# EAGLE design board (EAGLE 6.5.0)
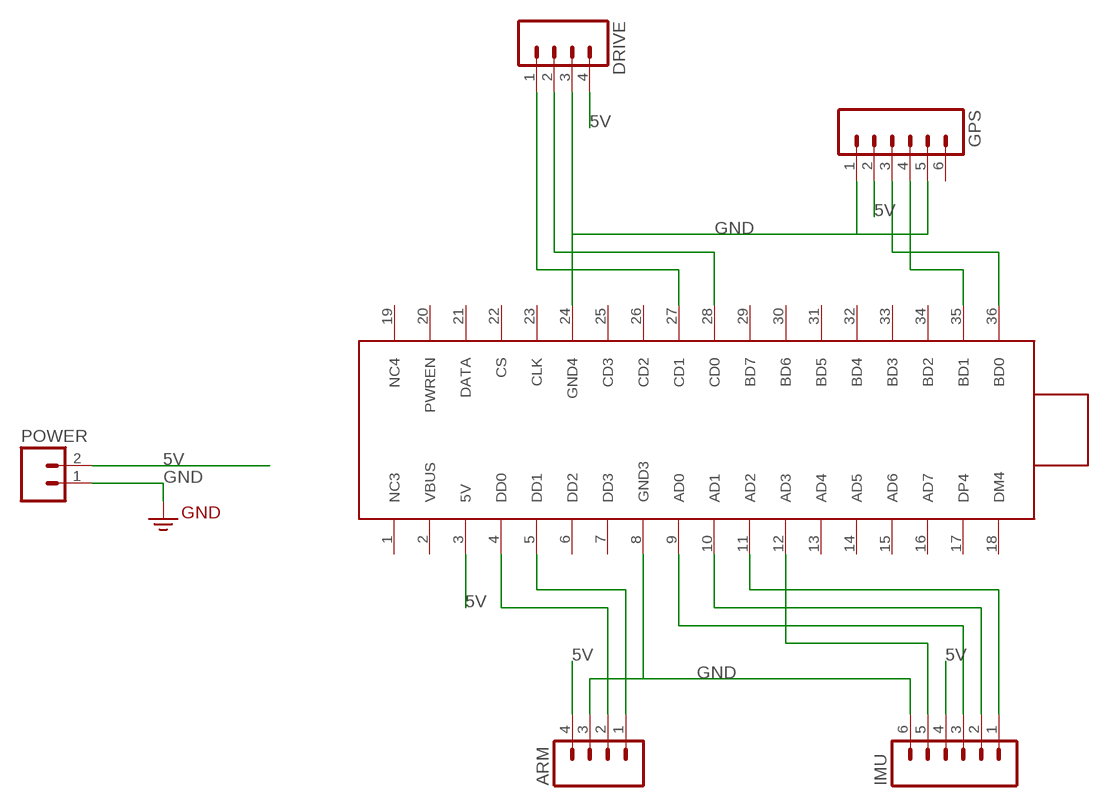
[diagram p0: schematic, sheet 1]

## Parts
ARM  M04PTH  [1X04]
DRIVE  M04PTH  [1X04]
GPS  M06SILK_FEMALE_PTH  [1X06]
IMU  M06SILK_FEMALE_PTH  [1X06]
POWER  M02PTH  [1X02]
U$1  HUB  [HUB]

## Nets
5V: ARM.4 DRIVE.4 GPS.2 IMU.4 POWER.2 U$1.3(5V)
GND: ARM.3 DRIVE.3 GPS.1 GPS.5 IMU.6 POWER.1 U$1.8(GND3) U$1.24(GND4) ; supply symbol labelled GND2
N$1: ARM.2 U$1.4(DD0)
N$2: ARM.1 U$1.5(DD1)
N$3: DRIVE.2 U$1.28(CD0)
N$4: DRIVE.1 U$1.27(CD1)
N$5: IMU.3 U$1.9(AD0)
N$6: IMU.2 U$1.10(AD1)
N$7: IMU.5 U$1.12(AD3)
N$8: IMU.1 U$1.11(AD2)
N$9: GPS.3 U$1.36(BD0)
N$10: GPS.4 U$1.35(BD1)
Unconnected: GPS.6 U$1.1(NC3) U$1.2(VBUS) U$1.6(DD2) U$1.7(DD3) U$1.13(AD4) U$1.14(AD5) U$1.15(AD6) U$1.16(AD7) U$1.17(DP4) U$1.18(DM4) U$1.19(NC4) U$1.20(PWREN) U$1.21(DATA) U$1.22(CS) U$1.23(CLK) U$1.25(CD3) U$1.26(CD2) U$1.29(BD7) U$1.30(BD6) U$1.31(BD5) U$1.32(BD4) U$1.33(BD3) U$1.34(BD2)

## Library data of the parts
ARM DRIVE = SparkFun-Connectors:M04: Header 4 Standard 4-pin 0.1" header. Use with straight break away headers (SKU : PRT-00116), right angle break away headers (PRT-00553), swiss pins (PRT-00743), machine pins (PRT-00117), and female headers (PRT-00115). Molex polarized connector foot print use with SKU : PRT-08231 with associated crimp pins and housings. 1MM SMD Version SKU: PRT-10208
GPS IMU = SparkFun-Connectors:M06: Header 6 Standard 6-pin 0.1" header. Use with straight break away headers (SKU : PRT-00116), right angle break away headers (PRT-00553), swiss pins (PRT-00743), machine pins (PRT-00117), and female headers (PRT-00115). Molex polarized connector foot print use with SKU : PRT-08094 with associated crimp pins and housings. NOTES ON THE VARIANTS LOCK and LOCK_LONGPADS... This footprint was designed to help hold the alignment of a through-hole component (i.e. 6-pin header) while soldering it into place. You may notice that each hole has been shifted either up or down by 0.005 of an inch from it's more standard position (which is a perfectly straight line). This slight alteration caused the pins (the squares in the middle) to touch the edges of the holes. Because they are alternating, it causes a "brace" to hold the component in place. 0.005 has proven to be the perfect amount of "off-center" position when using our standard breakaway headers. Although looks a little odd when you look at the bare footprint, once you have a header in there, the alteration is very hard to notice. Also,if you push a header all the way into place, it is covered up entirely on the bottom side. This idea of altering the position of holes to aid alignment will be further integrated into the Sparkfun Library for other footprints. It can help hold any component with 3 or more connection pins.; PROD_ID: CONN-08437
POWER = SparkFun-Connectors:M02: Standard 2-pin 0.1" header. Use with - straight break away headers ( PRT-00116) - right angle break away headers (PRT-00553) - swiss pins (PRT-00743) - machine pins (PRT-00117) - female headers (PRT-00115) Molex polarized connector foot print use with: PRT-08233 with associated crimp pins and housings. 2.54_SCREWTERM for use with PRT-10571. 3.5mm Screw Terminal footprints for PRT-08084 5mm Screw Terminal footprints for use with PRT-08432
U$1 = ft4232-usb-hub:HUB

## Board
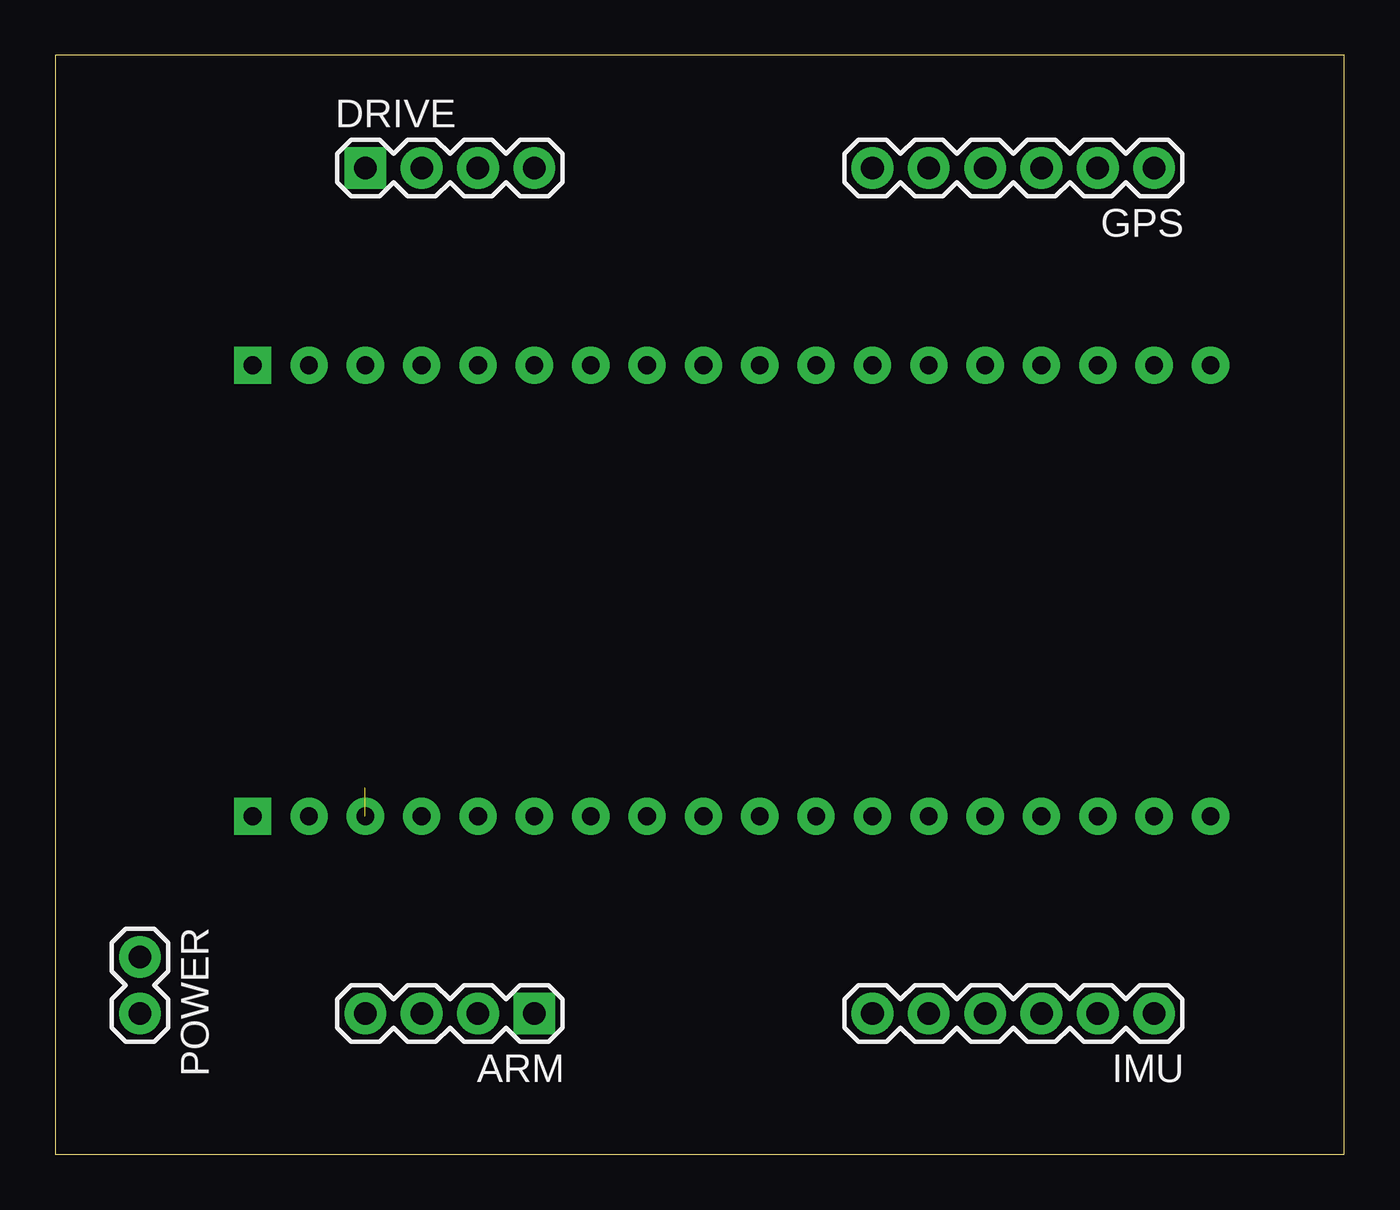
[diagram p1: board, top side]
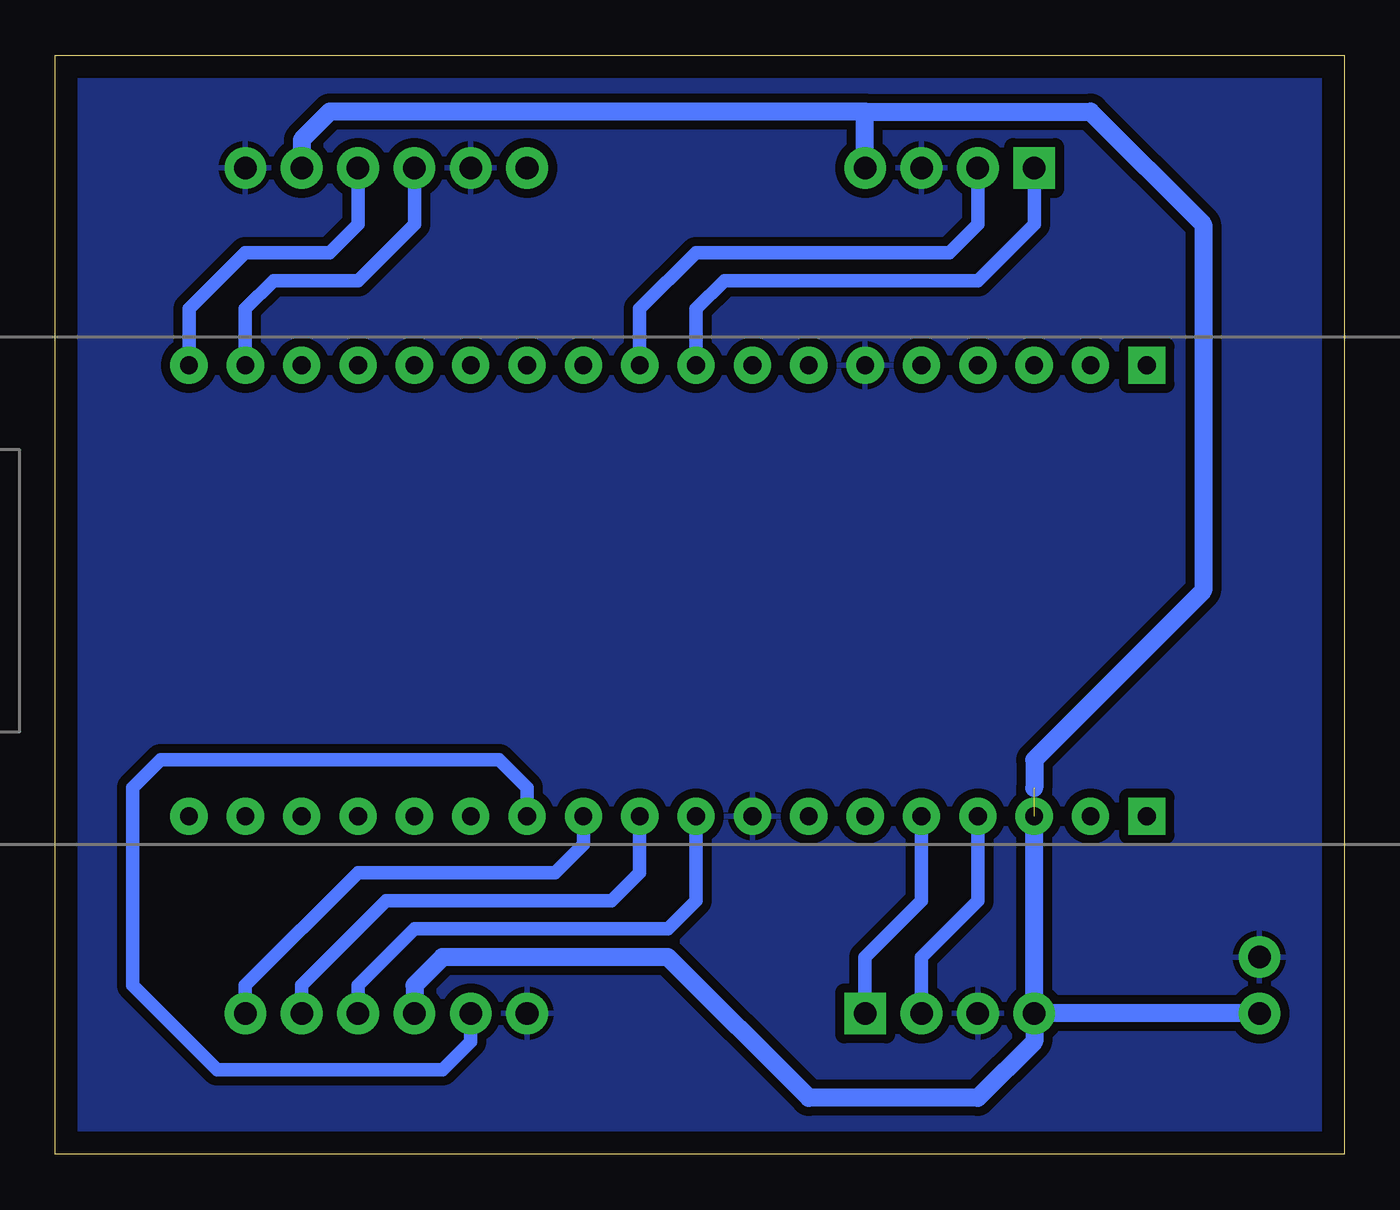
[diagram p2: board, bottom side, seen from below]

Size 58.09 x 49.52 mm. Coordinates in mm from the lower left corner, seen from the top.
Outline: 0,0 58.09,0 58.09,49.52 0,49.52 0,0
Copper layers (1*16): Top 0.035mm / dielectric 1.5mm / Bottom 0.035mm
Design rules "default": minimum track width 10mil, minimum drill 24mil, track to track 8mil, track to pad 8mil, pad to pad 8mil, via to via 8mil, smd to smd 8mil, copper to edge 40mil, drill to drill 8mil, minimum pad ring 10mil, minimum via ring 8mil, stop-mask expansion 4mil, vias tented up to drill 0mil, thermal gap 10mil

### Footprints (pad centres in the part's own frame; a part is rotated, then mirrored left to right if it is on the bottom)
1X04 = drill 1.016 pad 1.88 square: 1 0,0 | drill 1.016 pad 1.88: 2 2.54,0; 3 5.08,0; 4 7.62,0
1X06 = drill 1.016 pad 1.88: 1 0,0; 2 2.54,0; 3 5.08,0; 4 7.62,0; 5 10.16,0; 6 12.7,0
1X02 = drill 1.016 pad 1.88: 1 0,0; 2 2.54,0
HUB = drill 0.8 pad 1.676 square: 1 -13.97,16.51; 19 -13.97,-3.81 | drill 0.8 pad 1.676: 2 -11.43,16.51; 3 -8.89,16.51; 4 -6.35,16.51; 5 -3.81,16.51; 6 -1.27,16.51; 7 1.27,16.51; 8 3.81,16.51; 9 6.35,16.51; 10 8.89,16.51; 11 11.43,16.51; 12 13.97,16.51; 13 16.51,16.51; 14 19.05,16.51; 15 21.59,16.51; 16 24.13,16.51; 17 26.67,16.51; 18 29.21,16.51; 20 -11.43,-3.81; 21 -8.89,-3.81; 22 -6.35,-3.81; 23 -3.81,-3.81; 24 -1.27,-3.81; 25 1.27,-3.81; 26 3.81,-3.81; 27 6.35,-3.81; 28 8.89,-3.81; 29 11.43,-3.81; 30 13.97,-3.81; 31 16.51,-3.81; 32 19.05,-3.81; 33 21.59,-3.81; 34 24.13,-3.81; 35 26.67,-3.81; 36 29.21,-3.81

### Placement (x,y rotation side)
ARM  21.59,6.35 180 top
DRIVE  13.97,44.45 0 top
GPS  49.53,44.45 180 top
IMU  49.53,6.35 180 top
POWER  3.81,8.89 270 top
U$1  22.86,31.75 180 bottom

### Tracks (layer width: path | path; a pad name or v marks a point on that pad's centre or on a via)
5V  (1 unrouted)
  Bottom 0.813: POWER.2 ARM.4 | 21.59,46.99 45.72,46.99 46.99,45.72 GPS.2 | DRIVE.4 21.59,46.99 | 21.59,46.99 11.43,46.99 6.35,41.91 6.35,25.4 13.97,17.78 13.97,16.51 | ARM.4 13.97,5.08 16.51,2.54 24.13,2.54 30.48,8.89 40.64,8.89 41.91,7.62 IMU.4 | ARM.4 U$1.3
GND
  pour Bottom (isolate 0.406): -6.35,52.07 59.69,52.07 59.69,-2.54 -6.35,-2.54
N$1
  Bottom 0.61: ARM.2 19.05,8.89 16.51,11.43 U$1.4
N$2
  Bottom 0.61: ARM.1 21.59,8.89 19.05,11.43 U$1.5
N$3
  Bottom 0.61: DRIVE.2 16.51,41.91 17.78,40.64 29.21,40.64 31.75,38.1 U$1.28
N$4
  Bottom 0.61: U$1.27 29.21,38.1 27.94,39.37 16.51,39.37 13.97,41.91 DRIVE.1
N$5
  Bottom 0.61: IMU.3 44.45,7.62 41.91,10.16 30.48,10.16 29.21,11.43 U$1.9
N$6
  Bottom 0.61: IMU.2 46.99,7.62 43.18,11.43 33.02,11.43 31.75,12.7 U$1.10
N$7
  Bottom 0.61: IMU.5 39.37,5.08 40.64,3.81 50.8,3.81 54.61,7.62 54.61,16.51 53.34,17.78 38.1,17.78 36.83,16.51 U$1.12
N$8
  Bottom 0.61: IMU.1 49.53,7.62 44.45,12.7 35.56,12.7 34.29,13.97 U$1.11
N$9
  Bottom 0.61: GPS.3 44.45,41.91 45.72,40.64 49.53,40.64 52.07,38.1 U$1.36
N$10
  Bottom 0.61: GPS.4 41.91,41.91 44.45,39.37 48.26,39.37 49.53,38.1 U$1.35